# EAGLE design base_station_power_supply (EAGLE 6.5.0)
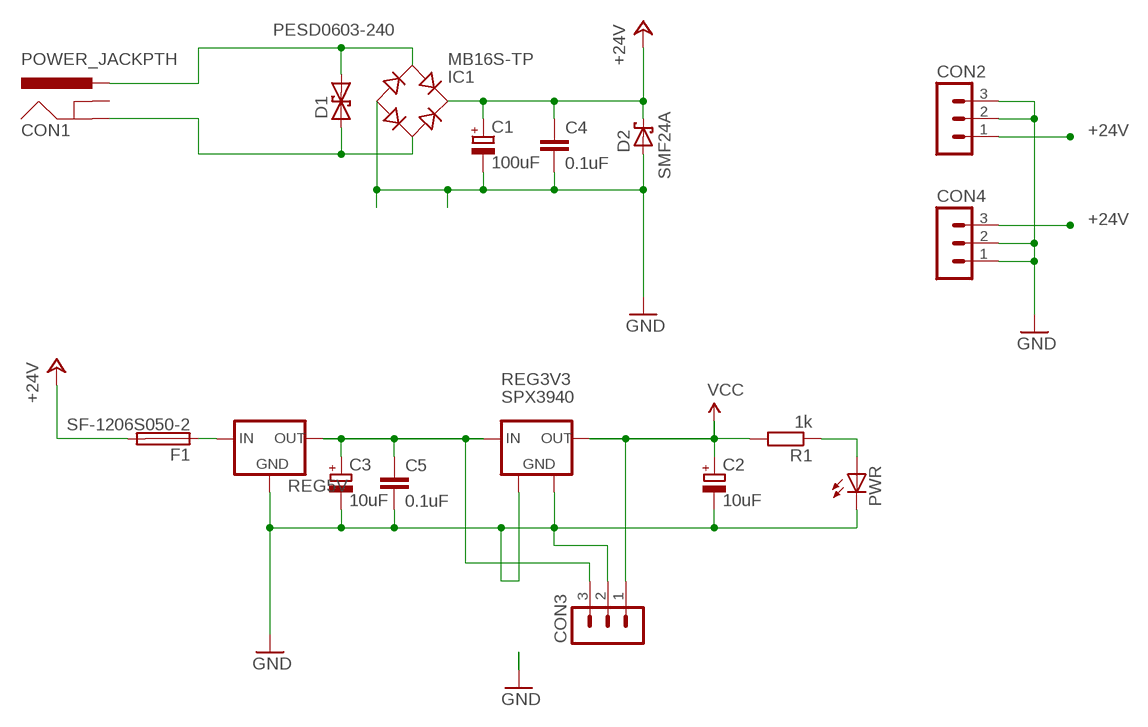
[diagram p0: schematic, sheet 1]

## Parts
C1  100uF  CPOL-EUE5-10.5  [E5-10,5]
C2  10uF  CPOL-EUE2-5  [E2-5]
C3  10uF  CPOL-EUE5-10.5  [E5-10,5]
C4  0.1uF  C-EUC0805  [C0805]
C5  0.1uF  C-EUC0805  [C0805]
CON1  POWER_JACKPTH  [POWER_JACK_PTH]
CON2  MA03-1  [MA03-1]
CON3  MA03-1  [MA03-1]
CON4  MA03-1  [MA03-1]
D1  PESD0603-240  [D0603]
D2  SMF24A  [SOD123]
F1  SF-1206S050-2  [F1206]
IC1  MB16S-TP  [SOIC-4]
PWR  LEDCHIPLED_0805  [CHIPLED_0805]
R1  1k  R-EU_R0603  [R0603]
REG3V3  SPX3940  [SOT223]
REG5V  V_REG_OKI-78SRSINK  [TO220-IGO]

## Nets
+5V: C3.+ C5.1 CON3.3 REG3V3.1(IN) REG5V.OUT
+24V: C1.+ C4.1 CON2.1 CON4.3 D2.C F1.2 IC1.+
GNDINT: C1.- C2.- C3.- C4.2 C5.2 CON2.2 CON2.3 CON3.2 CON4.1 CON4.2 D2.A IC1.- PWR.C REG3V3.2(GND) REG3V3.4(GND) REG5V.GND ; supply symbol labelled GND
N$2: PWR.A R1.1
N$3: F1.1 REG5V.IN
N$7: CON1.PWR D1.2 IC1.~1(AC1)
N$8: CON1.GND D1.1 IC1.~2(AC2)
VCC: C2.+ CON3.1 R1.2 REG3V3.3(OUT)
Unconnected: CON1.GNDBREAK

## Library data of the parts
C1-C3 = rcl:CPOL-EU: POLARIZED CAPACITOR, European symbol
C4 C5 = rcl:C-EU: CAPACITOR, European symbol
CON1 = SparkFun:POWER_JACK: Power Jack This is the standard 5.5mm barrel jack for power. The PTH is the most common, proven, reliable, footprint. All others are experimental. The Slot footprint only works if the mill layer is transmitted to the PCB fab house so be warned. Spark Fun Electronics SKU : PRT-00119. Mating wall wart : TOL-00298 (and others)
CON2-CON4 = con-lstb:MA03-1: PIN HEADER
D1 = texas_lvds:PESD0603-240: Bi Directional Transient Voltage Suppressor Diode (0603 package) by TE connectivity
D2 = texas_lvds:SMF24A: TVS DIODE 200W SOD-123F 24V UNI by Littelfuse Inc
F1 = texas_lvds:SF-1206S050-2: FUSE SLOW 63VDC 500MA 1206 (Manufacturer Bourns Inc.)
IC1 = texas_lvds:MB16S-TP: 1 Amp Surface Mount Schottky Bridge Rectifier 60 Volts by Micro Commercial Components
PWR = led:LED: LED OSRAM: - CHIPLED LG R971, LG N971, LY N971, LG Q971, LY Q971, LO R971, LY R971 LH N974, LH R974 LS Q976, LO Q976, LY Q976 LO Q996 - Hyper CHIPLED LW Q18S LB Q993, LB Q99A, LB R99A - SideLED LS A670, LO A670, LY A670, LG A670, LP A670 LB A673, LV A673, LT A673, LW A673 LH A674 LY A675 LS A676, LA A676, LO A676, LY A676, LW A676 LS A679, LY A679, LG A679 - Hyper Micro SIDELED® LS Y876, LA Y876, LO Y876, LY Y876 LT Y87S - SmartLED LW L88C, LW L88S LB L89C, LB L89S, LG L890 LS L89K, LO L89K, LY L89K LS L896, LA L896, LO L896, LY L896 - TOPLED LS T670, LO T670, LY T670, LG T670, LP T670 LSG T670, LSP T670, LSY T670, LOP T670, LYG T670 LG T671, LOG T671, LSG T671 LB T673, LV T673, LT T673, LW T673 LH T674 LS T676, LA T676, LO T676, LY T676, LB T676, LH T676, LSB T676, LW T676 LB T67C, LV T67C, LT T67C, LS T67K, LO T67K, LY T67K, LW E67C LS E67B, LA E67B, LO E67B, LY E67B, LB E67C, LV E67C, LT E67C LW T67C LS T679, LY T679, LG T679 LS T770, LO T770, LY T770, LG T770, LP T770 LB T773, LV T773, LT T773, LW T773 LH T774 LS E675, LA E675, LY E675, LS T675 LS T776, LA T776, LO T776, LY T776, LB T776 LHGB T686 LT T68C, LB T68C - Hyper Mini TOPLED® LB M676 - Mini TOPLED Santana® LG M470 LS M47K, LO M47K, LY M47K Source: http://www.osram.convergy.de LUXEON: - LUMILED® LXK2-PW12-R00, LXK2-PW12-S00, LXK2-PW14-U00, LXK2-PW14-V00 LXK2-PM12-R00, LXK2-PM12-S00, LXK2-PM14-U00 LXK2-PE12-Q00, LXK2-PE12-R00, LXK2-PE12-S00, LXK2-PE14-T00, LXK2-PE14-U00 LXK2-PB12-K00, LXK2-PB12-L00, LXK2-PB12-M00, LXK2-PB14-N00, LXK2-PB14-P00, LXK2-PB14-Q00 LXK2-PR12-L00, LXK2-PR12-M00, LXK2-PR14-Q00, LXK2-PR14-R00 LXK2-PD12-Q00, LXK2-PD12-R00, LXK2-PD12-S00 LXK2-PH12-R00, LXK2-PH12-S00 LXK2-PL12-P00, LXK2-PL12-Q00, LXK2-PL12-R00 Source: www.luxeon.com KINGBRIGHT: KA-3528ASYC Source: www.kingbright.com
R1 = rcl:R-EU_: RESISTOR, European symbol
REG3V3 = texas_lvds:SPX3940: Voltage regulator with a low drop out voltage of 280mV (typical) at 1A
REG5V = texas_lvds:V_REG_OKI-78SR: Voltage Regulator Standard 7805 5V regulator. IGO (Input Ground Output). Spark Fun Electronics SKU : COM-00107

## Board
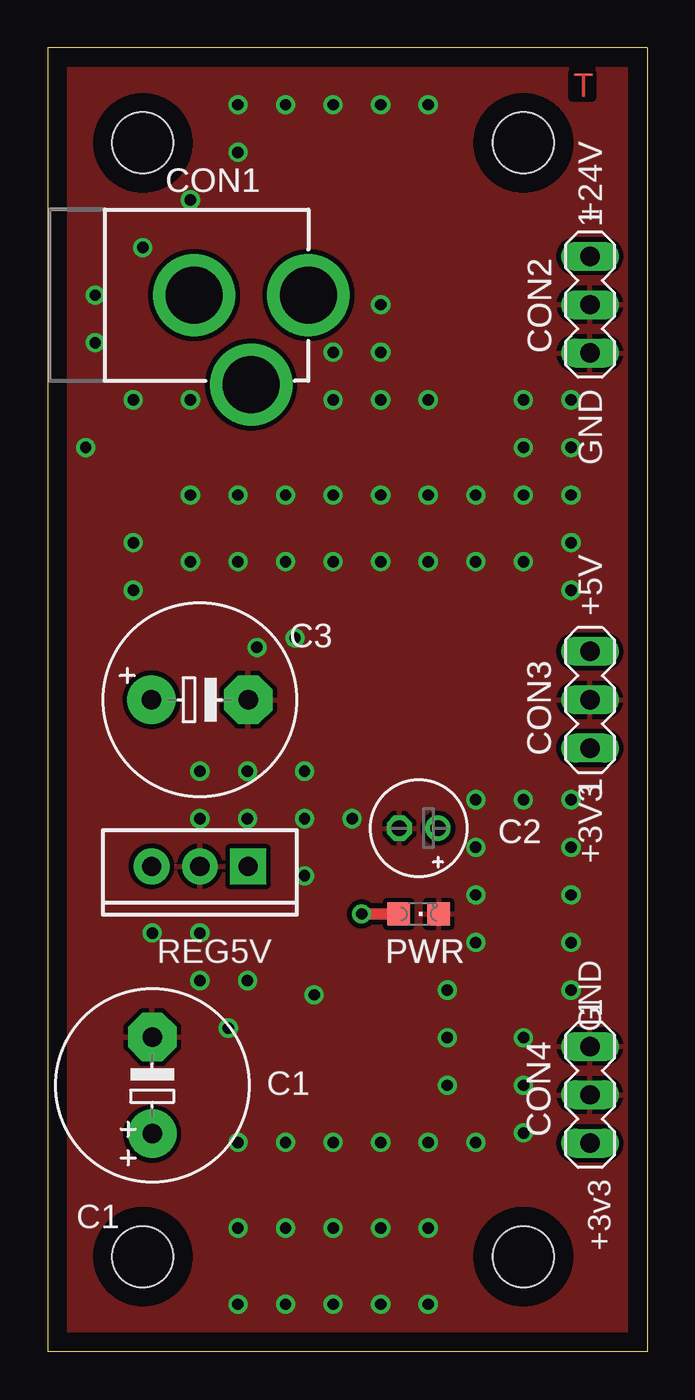
[diagram p1: board, top side]
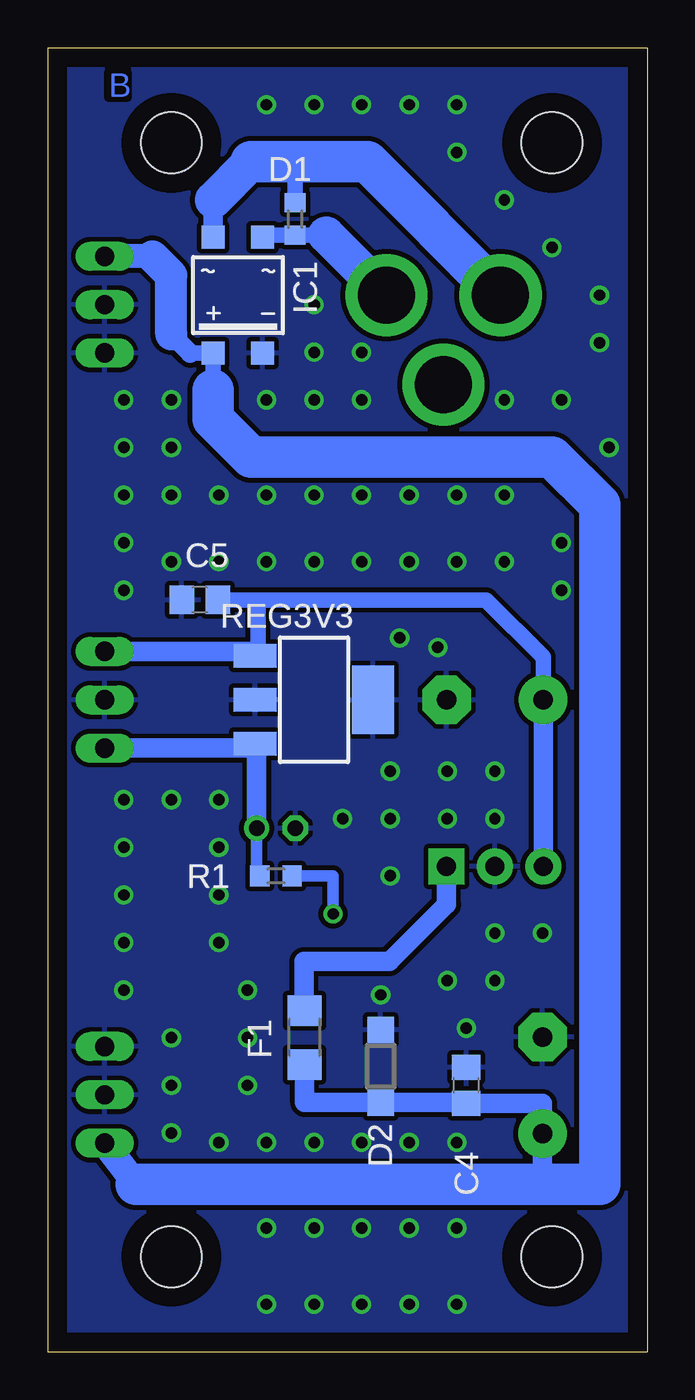
[diagram p2: board, bottom side, seen from below]

Size 31.5 x 68.5 mm. Coordinates in mm from the lower left corner, seen from the top.
Outline: 31.5,0 0,0 0,68.5 31.5,68.5 31.5,0
Copper layers (1*16): Top 0.035mm / dielectric 1.5mm / Bottom 0.035mm
Design rules "default": minimum track width 10mil, minimum drill 0.6mm, track to track 6mil, track to pad 6mil, pad to pad 6mil, via to via 6mil, smd to smd 6mil, copper to edge 40mil, drill to drill 8mil, minimum pad ring 10mil, minimum via ring 8mil, stop-mask expansion 4mil, vias tented up to drill 0.6mm, thermal gap 10mil
Holes 3.2 mm at 25,5 5,63.5 5,5 25,63.5

### Footprints (pad centres in the part's own frame; a part is rotated, then mirrored left to right if it is on the bottom)
E5-10,5 = drill 1.016 pad 2.54: + -2.54,0 | drill 1.016 pad 2.54 octagon: - 2.54,0
E2-5 = drill 0.813 pad 1.27: + -1.016,0 | drill 0.813 pad 1.27 octagon: - 1.016,0
C0805 = smd 1.3 x 1.5: 1 -0.95,0; 2 0.95,0
POWER_JACK_PTH = drill 2.997 pad 4.318: GND 0,7.7; GNDBREAK 4.7,10.7; PWR 0,13.7
MA03-1 = drill 1.016 long: 1 -2.54,0; 2 0,0; 3 2.54,0
D0603 = smd 1 x 1.1: 1 -0.85,0; 2 0.85,0
SOD123 = smd 1.4 x 1.4: A 1.9,0; C -1.9,0
F1206 = smd 1.6 x 1.803: 1 -1.422,0; 2 1.422,0
SOIC-4 = smd 1.2 x 1.2: + 1.3,3.05; - -1.3,3.05; ~1 -1.3,-3.05; ~2 1.3,-3.05
CHIPLED_0805 = smd 1.2 x 1.2: A 0,-1.05; C 0,1.05
R0603 = smd 1 x 1.1: 1 -0.85,0; 2 0.85,0
SOT223 = smd 1.219 x 2.235: 1 -2.311,-3.099; 2 0,-3.099; 3 2.311,-3.099 | smd 3.6 x 2.2: 4 0,3.099
TO220-IGO = drill 1 pad 1.88: GND 0,0; OUT 2.54,0 | drill 1 pad 1.88 square: IN -2.54,0

### Placement (x,y rotation side)
C1  5.5,14 90 top
C2  19.5,27.5 180 top
C3  8,34.25 0 top
C4  9.5,14 90 bottom
C5  23.5,39.5 180 bottom
CON1  0,55.5 270 top
CON2  28.5,55 270 top
CON3  28.5,34.25 90 top
CON4  28.5,13.5 270 top
D1  18.5,59.5 270 bottom
D2  14,15 90 bottom
F1  18,16.5 270 bottom
IC1  21.5,55.5 180 bottom
PWR  19.5,23 270 top
R1  19.5,25 180 bottom
REG3V3  17.5,34.25 270 bottom
REG5V  8,25.5 180 top

### Tracks (layer width: path | path; a pad name or v marks a point on that pad's centre or on a via)
+5V
  Bottom 0.813: C3.+ 5.46,36.5 8.46,39.5 20.45,39.5 | REG3V3.1 20.6,36.5 20.45,36.5 20.45,39.5 | 20.45,39.5 C5.1
  Bottom 1.016: CON3.3 20.6,36.79 REG3V3.1 | REG5V.OUT C3.+
+24V
  Bottom 0.61: 18.04,13.1 18,13.1
  Bottom 0.813: 22.8,50.5 IC1.+ 24,52.45
  Bottom 1.016: F1.2 18,13.1 D2.C 9.5,13.1 C4.1 5.5,13.05 C1.+ 5.5,8.8 | 24,52.45 25,53.45
  Bottom 1.27: 26,57.54 CON2.1
  Bottom 1.422: CON4.3 26.84,8.8
  Bottom 1.676: 25,53.45 25,56.54 26,57.54
  Bottom 2.184: 26.84,8.8 5.5,8.8 2.5,8.8 2.5,44.5 5,47 20.8,47 22.8,49 22.8,50.5
GNDINT  (via drill 0.6)
  other vias: 9.5,17 11,37 14,18.75 13,37.5 27.5,50 27.5,47.5 27.5,45 27.5,40 27.5,42.5 25,50 25,47.5 25,45 22.5,45 20,45 17.5,45 15,45 12.5,45 10,45 7.5,45 4.5,42.5 4.5,40 20,41.5 17.5,41.5 15,41.5 12.5,41.5 10,41.5 7.5,41.5 20,50 17.5,50 15,50 7.5,50 4.5,50 17.5,52.5 17.5,55 15,52.5 10,63 7.5,60.5 5,58 2.5,55.5 2.5,53 27.5,29 27.5,26.5 27.5,24 27.5,21.5 27.5,19 25,16.5 25,14 25,11.5 22.5,11 20,11 17.5,11 15,11 12.5,11 10,11 20,6.5 17.5,6.5 15,6.5 12.5,6.5 10,6.5 21,14 21,16.5 21,19 25,29 22.5,29 22.5,26.5 22.5,24 22.5,21.5 8,28 8,30.5 10.5,30.5 13.5,30.5 16,28 13.5,28 13.5,25 10.5,28 10.5,19.5 8,22 5.5,22 8,19.5 22.5,41.5 25,41.5 2,47.5 20,2.5 17.5,2.5 15,2.5 12.5,2.5 10,2.5 20,65.5 17.5,65.5 15,65.5 12.5,65.5 10,65.5
  pour Bottom (isolate 0.254): 31.5,68.5 31.5,0 0,0 0,68.5
  pour Top (isolate 0.254, rank 2): 31.5,68.5 31.5,0 0,0 0,68.5
N$2  (via drill 0.6)
  Top 0.61: PWR.A v16.5,23
  Bottom 0.61: R1.1 16.5,25 v16.5,23
N$3
  Bottom 0.61: F1.1 18.04,17.92
  Bottom 1.016: 18.04,17.92 18.04,20.5 13.54,20.5 10.54,23.5 REG5V.IN
N$7
  Bottom 0.813: 16.85,58.65 D1.2 20.2,58.65 IC1.~1
  Bottom 1.93: CON1.PWR 16.85,58.65
N$8
  Bottom 0.813: D1.1 18.5,62.5
  Bottom 1.016: IC1.~2 22.8,60.5
  Bottom 1.93: 22.8,60.5 20.8,62.5
  Bottom 2.184: CON1.GND 14.7,62.5 18.5,62.5 20.8,62.5
VCC
  Bottom 0.61: C2.+ 20.52,25 R1.2
  Bottom 1.016: CON3.1 20.6,31.71 | 20.6,31.71 REG3V3.3 | 20.6,31.71 20.52,31.71 C2.+

### Text on the board
Top: T
Bottom: B
tDocu: +24V | +5V | +3V3 | GND | +3v3
_tsilk: +24V | CON1 | CON2 | GND | +5V | C3 | CON3 | C2 | +3V3 | GND | REG5V | PWR | CON4 | C1 | +3v3
_bsilk: D1 | IC1 | C5 | REG3V3 | R1 | F1 | D2 | C4